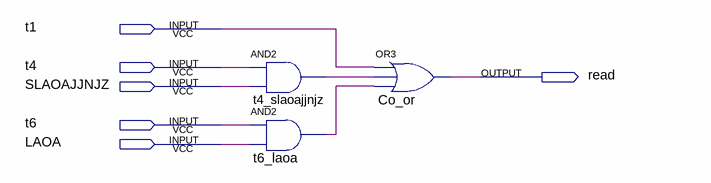
[diagram p0: schematic sheet]
// Quartus schematic read.bdf as structural Verilog: 3 symbols, 6 pins
module read (
  input  t1,
  input  t4,
  input  SLAOAJJNJZ,
  input  t6,
  input  LAOA,
  output read
);

  wire t4_slaoajjnjz_out, t6_laoa_out;

  and t4_slaoajjnjz (t4_slaoajjnjz_out, t4, SLAOAJJNJZ);
  and t6_laoa (t6_laoa_out, t6, LAOA);
  or Co_or (read, t1, t4_slaoajjnjz_out, t6_laoa_out);
endmodule
